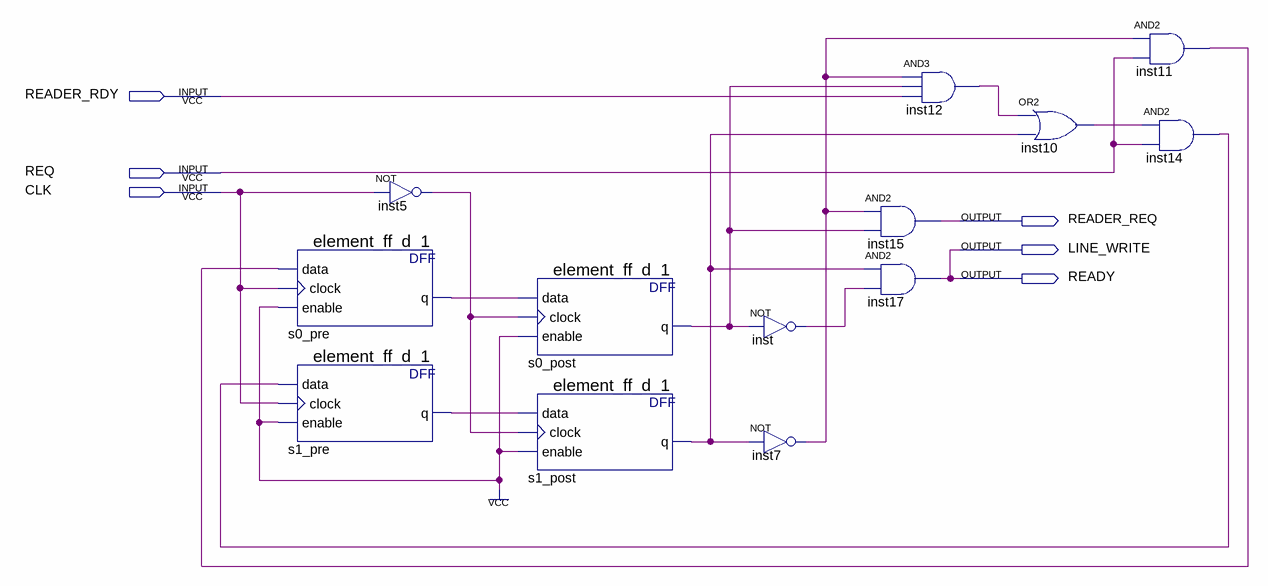
[diagram p0: schematic sheet]
// Quartus schematic block-data-cache-state-machine-rm.bdf as structural Verilog: 13 symbols, 6 pins
module \block-data-cache-state-machine-rm  (
  input  READER_RDY,
  input  REQ,
  input  CLK,
  output READER_REQ,
  output LINE_WRITE,
  output READY
);

  wire inst5_out, inst7_out, inst10_out, inst11_out, inst12_out, inst14_out, inst_out, s0_post_q, s0_pre_q,
       s1_post_q, s1_pre_q;

  element_ff_d_1 s0_pre (.data(inst11_out), .clock(CLK), .enable(1'b1), .q(s0_pre_q));
  element_ff_d_1 s1_pre (.data(inst14_out), .clock(CLK), .enable(1'b1), .q(s1_pre_q));
  not inst5 (inst5_out, CLK);
  element_ff_d_1 s0_post (.data(s0_pre_q), .clock(inst5_out), .enable(1'b1), .q(s0_post_q));
  element_ff_d_1 s1_post (.data(s1_pre_q), .clock(inst5_out), .enable(1'b1), .q(s1_post_q));
  not inst (inst_out, s0_post_q);
  not inst7 (inst7_out, s1_post_q);
  and inst12 (inst12_out, inst7_out, s0_post_q, READER_RDY);
  and inst15 (READER_REQ, inst7_out, s0_post_q);
  and inst17 (LINE_WRITE, s1_post_q, inst_out);
  or inst10 (inst10_out, inst12_out, s1_post_q);
  and inst11 (inst11_out, inst7_out, REQ);
  and inst14 (inst14_out, inst10_out, REQ);

  assign READY = LINE_WRITE;
endmodule
